# EAGLE design Layer1_v1.0 (EAGLE 6.2)
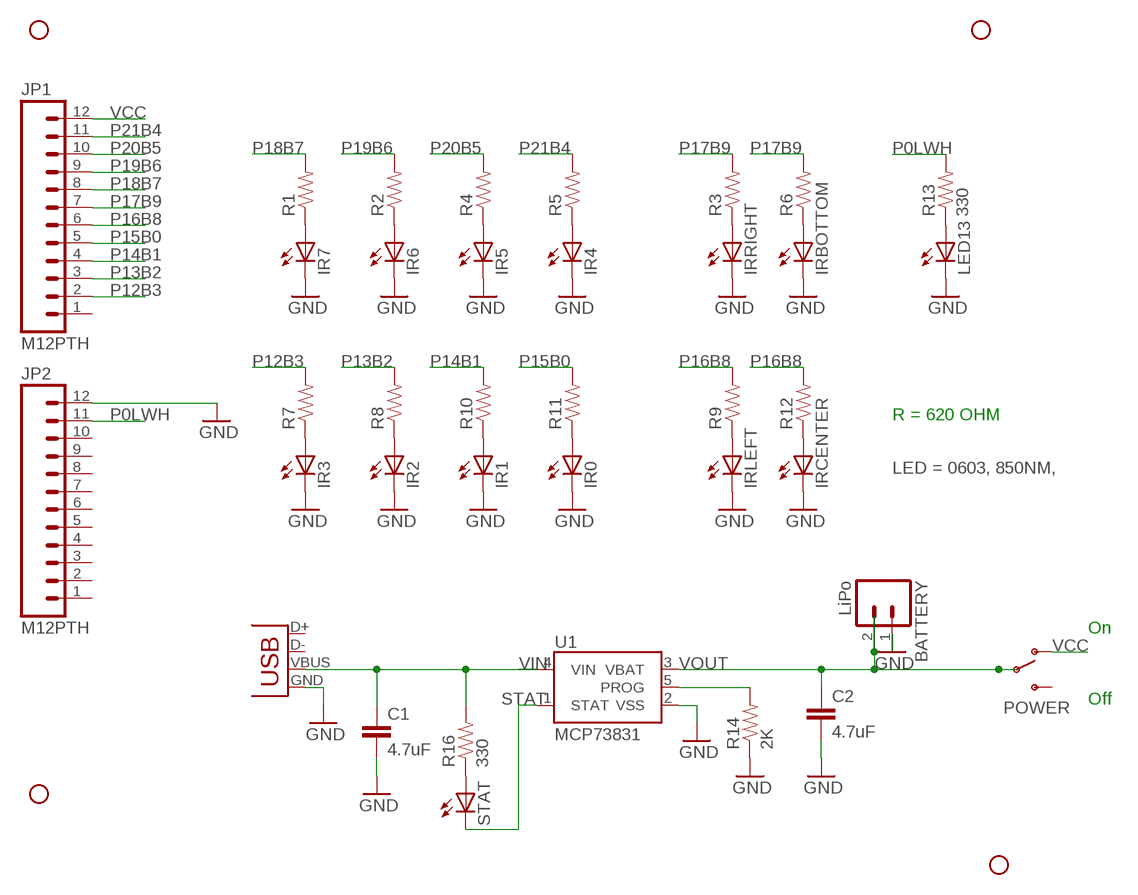
[diagram p0: schematic, sheet 1]

## Parts
BATTERY  LiPo  M02-JST-2MM-SMT  [JST-2-SMD]
C1  4.7uF  CAP0603-CAP  [0603-CAP]
C2  4.7uF  CAP0603-CAP  [0603-CAP]
IR0  LEDCHIPLED_0603  [CHIPLED_0603]
IR1  LEDCHIPLED_0603  [CHIPLED_0603]
IR2  LEDCHIPLED_0603  [CHIPLED_0603]
IR3  LEDCHIPLED_0603  [CHIPLED_0603]
IR4  LEDCHIPLED_0603  [CHIPLED_0603]
IR5  LEDCHIPLED_0603  [CHIPLED_0603]
IR6  LEDCHIPLED_0603  [CHIPLED_0603]
IR7  LEDCHIPLED_0603  [CHIPLED_0603]
IRBOTTOM  LEDCHIPLED_0603  [CHIPLED_0603]
IRCENTER  LEDCHIPLED_0603  [CHIPLED_0603]
IRLEFT  LEDCHIPLED_0603  [CHIPLED_0603]
IRRIGHT  LEDCHIPLED_0603  [CHIPLED_0603]
JP1  M12PTH  [1X12]
JP2  M12PTH  [1X12]
JP4  STAND-OFF  [STAND-OFF]
JP5  STAND-OFF  [STAND-OFF]
JP6  STAND-OFF  [STAND-OFF]
JP7  STAND-OFF  [STAND-OFF]
LED13  LEDCHIPLED_0603  [CHIPLED_0603]
POWER  SWITCH-SPDTPTH  [SWITCH-SPDT]
R1  RESISTOR0603-RES  [0603-RES]
R2  RESISTOR0603-RES  [0603-RES]
R3  RESISTOR0603-RES  [0603-RES]
R4  RESISTOR0603-RES  [0603-RES]
R5  RESISTOR0603-RES  [0603-RES]
R6  RESISTOR0603-RES  [0603-RES]
R7  RESISTOR0603-RES  [0603-RES]
R8  RESISTOR0603-RES  [0603-RES]
R9  RESISTOR0603-RES  [0603-RES]
R10  RESISTOR0603-RES  [0603-RES]
R11  RESISTOR0603-RES  [0603-RES]
R12  RESISTOR0603-RES  [0603-RES]
R13  330  RESISTOR0603-RES  [0603-RES]
R14  2K  RESISTOR0603-RES  [0603-RES]
R16  330  RESISTOR0603-RES  [0603-RES]
STAT  LEDCHIPLED_0603  [CHIPLED_0603]
U1  MCP73831  [SOT23-5]
X1  USBSMD  [USB-MINIB]

## Nets
GND: BATTERY.1 C1.2 C2.2 IR0.C IR1.C IR2.C IR3.C IR4.C IR5.C IR6.C IR7.C IRBOTTOM.C IRCENTER.C IRLEFT.C IRRIGHT.C JP2.12 LED13.C R14.1 U1.2(VSS) X1.GND
N$1: LED13.A R13.1
N$2: IR3.A R7.1
N$3: IRRIGHT.A R3.1
N$4: IR5.A R4.1
N$5: IR4.A R5.1
N$6: IRBOTTOM.A R6.1
N$7: IR6.A R2.1
N$8: IR2.A R8.1
N$9: IRLEFT.A R9.1
N$10: IR1.A R10.1
N$11: IR0.A R11.1
N$12: IRCENTER.A R12.1
N$13: IR7.A R1.1
N$14: R16.1 STAT.A
P0LWH: JP2.11 R13.2
P12B3: JP1.2 R7.2
P13B2: JP1.3 R8.2
P14B1: JP1.4 R10.2
P15B0: JP1.5 R11.2
P16B8: JP1.6 R9.2 R12.2
P17B9: JP1.7 R3.2 R6.2
P18B7: JP1.8 R1.2
P19B6: JP1.9 R2.2
P20B5: JP1.10 R4.2
P21B4: JP1.11 R5.2
PROG: R14.2 U1.5(PROG)
STAT: STAT.C U1.1(STAT)
VCC: JP1.12 POWER.1(O)
VIN: C1.1 R16.2 U1.4(VIN) X1.VBUS
VOUT: BATTERY.2 C2.1 POWER.2(P) U1.3(VBAT)
Unconnected: JP1.1 JP2.1 JP2.2 JP2.3 JP2.4 JP2.5 JP2.6 JP2.7 JP2.8 JP2.9 JP2.10 POWER.3(S) X1.D+ X1.D-

## Notes on the sheet
- R = 620 OHM
- LED = 0603, 850NM,
- On
- Off

## Library data of the parts
BATTERY = SparkFun-Connectors:M02: Header 2 Standard 2-pin 0.1" header. Use with straight break away headers (SKU : PRT-00116), right angle break away headers (PRT-00553), swiss pins (PRT-00743), machine pins (PRT-00117), and female headers (PRT-00115). Molex polarized connector foot print use with SKU : PRT-08233 with associated crimp pins and housings.
C1 C2 = SparkFun-Passives:CAP: Capacitor Standard 0603 ceramic capacitor, and 0.1" leaded capacitor.
IR0 IR1-IR7 IRBOTTOM IRCENTER IRLEFT IRRIGHT LED13 STAT = adafruit:LED: LED OSRAM: - CHIPLED LG R971, LG N971, LY N971, LG Q971, LY Q971, LO R971, LY R971 LH N974, LH R974 LS Q976, LO Q976, LY Q976 LO Q996 - Hyper CHIPLED LW Q18S LB Q993, LB Q99A, LB R99A - SideLED LS A670, LO A670, LY A670, LG A670, LP A670 LB A673, LV A673, LT A673, LW A673 LH A674 LY A675 LS A676, LA A676, LO A676, LY A676, LW A676 LS A679, LY A679, LG A679 - Hyper Micro SIDELED® LS Y876, LA Y876, LO Y876, LY Y876 LT Y87S - SmartLED LW L88C, LW L88S LB L89C, LB L89S, LG L890 LS L89K, LO L89K, LY L89K LS L896, LA L896, LO L896, LY L896 - TOPLED LS T670, LO T670, LY T670, LG T670, LP T670 LSG T670, LSP T670, LSY T670, LOP T670, LYG T670 LG T671, LOG T671, LSG T671 LB T673, LV T673, LT T673, LW T673 LH T674 LS T676, LA T676, LO T676, LY T676, LB T676, LH T676, LSB T676, LW T676 LB T67C, LV T67C, LT T67C, LS T67K, LO T67K, LY T67K, LW E67C LS E67B, LA E67B, LO E67B, LY E67B, LB E67C, LV E67C, LT E67C LW T67C LS T679, LY T679, LG T679 LS T770, LO T770, LY T770, LG T770, LP T770 LB T773, LV T773, LT T773, LW T773 LH T774 LS E675, LA E675, LY E675, LS T675 LS T776, LA T776, LO T776, LY T776, LB T776 LHGB T686 LT T68C, LB T68C - Hyper Mini TOPLED® LB M676 - Mini TOPLED Santana® LG M470 LS M47K, LO M47K, LY M47K Source: http://www.osram.convergy.de/
JP1 JP2 = SparkFun-Connectors:M12: Header 12 Standard 12-pin 0.1" header. Use with straight break away headers (SKU : PRT-00116), right angle break away headers (PRT-00553), swiss pins (PRT-00743), machine pins (PRT-00117), and female headers (PRT-00115).
JP4-JP7 = SparkFun-Electromechanical:STAND-OFF: #4 Stand Off This is the mechanical footprint for a #4 phillips button head screw. Use the keepout ring to avoid running the screw head into surrounding components. SKU : PRT-00447
POWER = SparkFun-Electromechanical:SWITCH-SPDT: SPST Switch Simple slide switch. Spark Fun Electronics SKU : COM-00102
R1-R14 R16 = SparkFun-Passives:RESISTOR: Resistor Basic schematic elements and footprints for 0603, 1206, and PTH resistors.
U1 = SparkFun-PowerIC:MCP73831: Miniature single cell, fully integrated Li-Ion, Li-polymer charge management controller http://ww1.microchip.com/downloads/en/DeviceDoc/21984a.pdf
X1 = SparkFun-Connectors:USB: USB Connectors USB-B-PTH is fully proven SKU : PRT-00139 USB-miniB is fully proven SKU : PRT-00587 USB-A-PCB is untested. USB-A-H is throughly reviewed, but untested. Spark Fun Electronics SKU : PRT-00437 USB-B-SMT is throughly reviewed, but untested. Needs silkscreen touching up. USB-A-S has not been used/tested USB-MB-H has not been used/tested

## Board
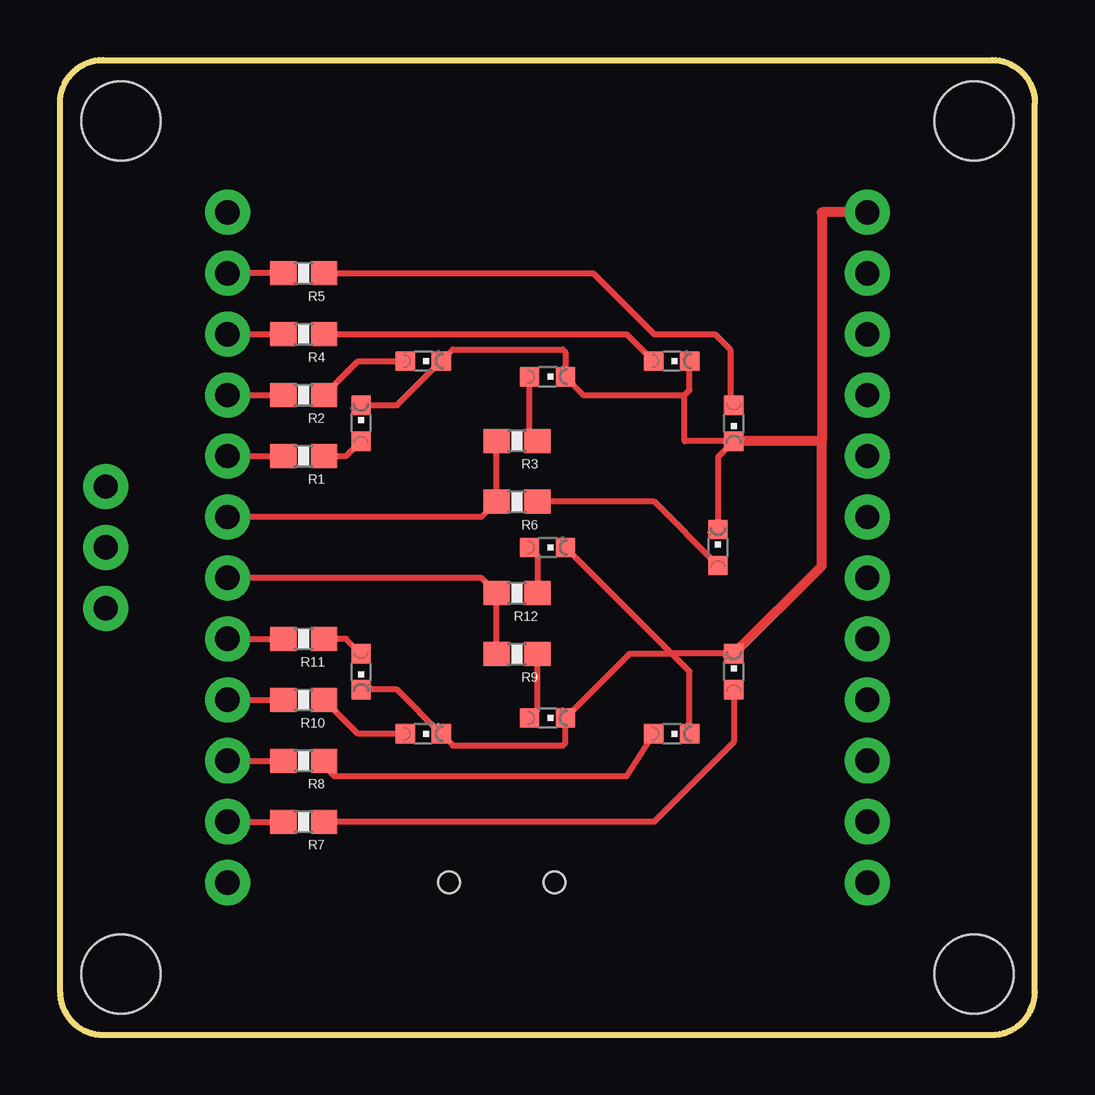
[diagram p1: board, top side]
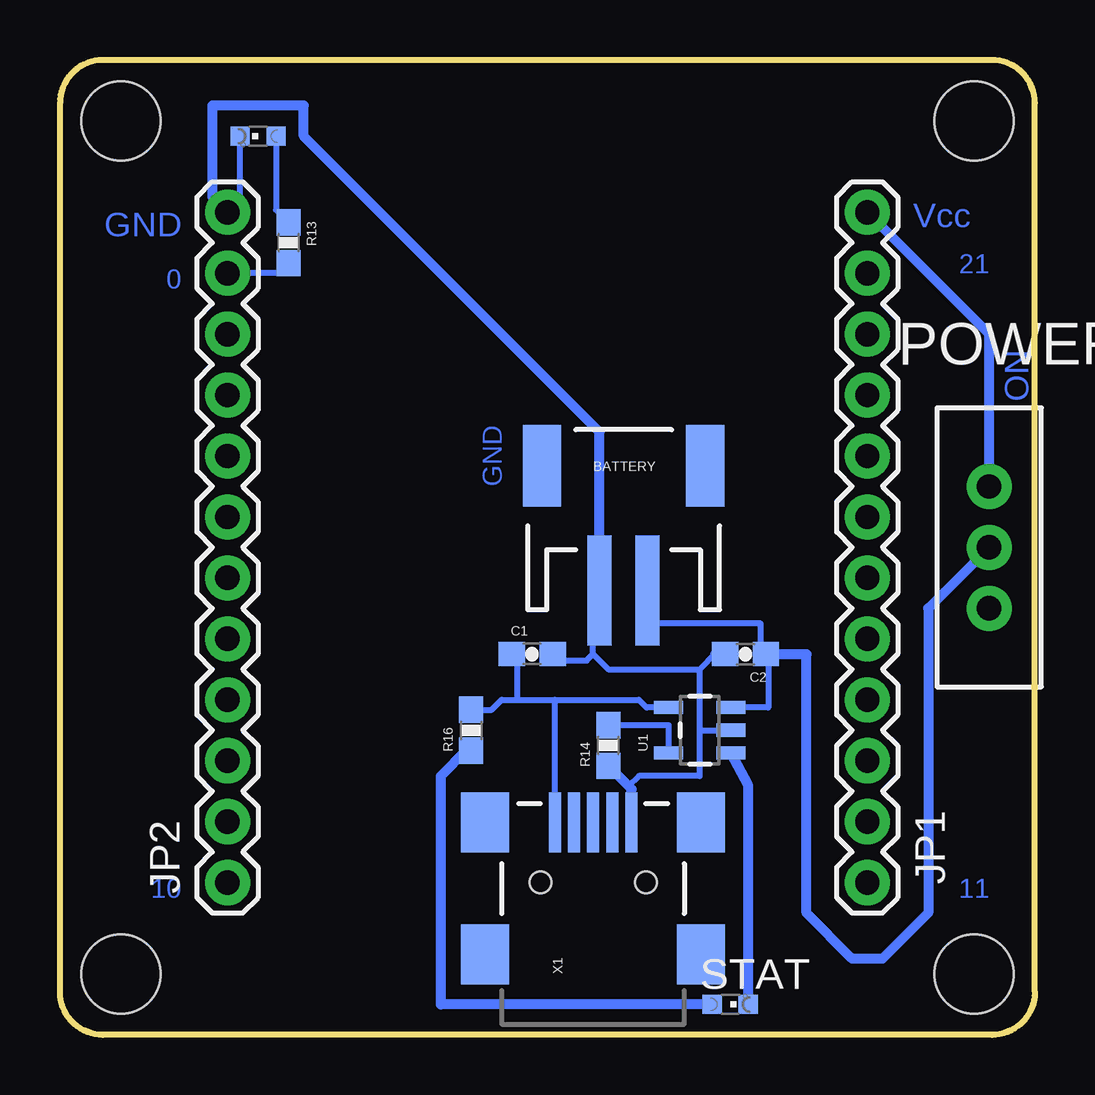
[diagram p2: board, bottom side, seen from below]

Size 40.64 x 40.64 mm. Coordinates in mm from the lower left corner, seen from the top.
Outline: 0,1.8 0,38.84 arc-90 1.8,40.64 38.84,40.64 arc-90 40.64,38.84 40.64,1.8 arc-90 38.84,0 1.8,0 arc-90 0,1.8
Copper layers (1*16): Top 0.035mm / dielectric 1.5mm / Bottom 0.035mm
Design rules: minimum track width 6mil, minimum drill 24mil, track to track 8mil, track to pad 8mil, pad to pad 8mil, via to via 8mil, smd to smd 8mil, copper to edge 40mil, drill to drill 8mil, minimum pad ring 10mil, minimum via ring 8mil, stop-mask expansion 4mil, vias tented up to drill 0mil, thermal gap 10mil

### Footprints (pad centres in the part's own frame; a part is rotated, then mirrored left to right if it is on the bottom)
JST-2-SMD = smd 1 x 4.6: 1 -1,-3.7; 2 1,-3.7 | smd 1.6 x 3.4: NC1 -3.4,1.5; NC2 3.4,1.5
0603-CAP = smd 1.1 x 1: 1 -0.85,0; 2 0.85,0
CHIPLED_0603 = smd 0.8 x 0.8: A 0,-0.75; C 0,0.75
1X12 = drill 1.016 pad 1.88: 1 0,0; 2 2.54,0; 3 5.08,0; 4 7.62,0; 5 10.16,0; 6 12.7,0; 7 15.24,0; 8 17.78,0; 9 20.32,0; 10 22.86,0; 11 25.4,0; 12 27.94,0
STAND-OFF = hole 3.302: 0,0
SWITCH-SPDT = drill 1.016 pad 1.88: 1 0,2.54; 2 0,0; 3 0,-2.54
0603-RES = smd 1.1 x 1: 1 -0.85,0; 2 0.85,0
SOT23-5 = smd 0.55 x 1.2: 1 -0.95,-1.3; 2 0,-1.3; 3 0.95,-1.3; 4 0.95,1.3; 5 -0.95,1.3
USB-MINIB = smd 2.5 x 0.5: D+ 2.5,0; D- 2.5,0.8; GND 2.5,-1.6; ID 2.5,-0.8; VBUS 2.5,1.6 | smd 2.5 x 2: MTN1 -3,4.5; MTN2 2.5,4.5; MTN3 -3,-4.5; MTN4 2.5,-4.5 | hole 0.9: 0,2.2; 0,-2.2

### Placement (x,y rotation side)
BATTERY  17.14,22.23 0 bottom
C1  20.95,15.88 0 bottom
C2  12.06,15.88 180 bottom
IR0  12.55,15.14 180 top
IR1  15.14,12.55 270 top
IR2  25.5,12.55 270 top
IR3  28.09,15.14 0 top
IR4  28.09,25.5 180 top
IR5  25.5,28.09 270 top
IR6  15.14,28.09 270 top
IR7  12.55,25.5 0 top
IRBOTTOM  27.43,20.32 0 top
IRCENTER  20.32,20.32 270 top
IRLEFT  20.32,13.21 270 top
IRRIGHT  20.32,27.43 270 top
JP1  6.99,6.35 90 bottom
JP2  33.66,6.35 90 bottom
JP4  38.1,2.54 0 top
JP5  2.54,2.54 0 top
JP6  2.54,38.1 0 top
JP7  38.1,38.1 0 top
LED13  32.38,37.47 90 bottom
POWER  1.91,20.32 0 bottom
R1  10.16,24.13 180 top
R2  10.16,26.67 180 top
R3  19.05,24.77 180 top
R4  10.16,29.21 180 top
R5  10.16,31.75 180 top
R6  19.05,22.23 180 top
R7  10.16,8.89 180 top
R8  10.16,11.43 180 top
R9  19.05,15.88 180 top
R10  10.16,13.97 180 top
R11  10.16,16.51 180 top
R12  19.05,18.41 180 top
R13  31.11,33.02 270 bottom
R14  17.78,12.06 90 bottom
R16  23.5,12.7 90 bottom
STAT  12.7,1.27 270 bottom
U1  13.97,12.7 90 bottom
X1  18.41,6.35 90 bottom

### Tracks (layer width: path | path; a pad name or v marks a point on that pad's centre or on a via)
GND
  Top 0.254: IR7.C 14.05,26.25 IR6.C 16.38,28.57 20.95,28.57 21.07,28.46 IRRIGHT.C 21.83,26.67 26.04,26.67 | 26.04,26.67 26.25,26.88 IR5.C | 26.04,26.67 26.04,24.75 IR4.C 27.43,24.09 IRBOTTOM.C | IR3.C 25.5,15.89 | 25.5,15.89 IRCENTER.C | IR0.C 14.05,14.39 IR1.C 16.38,12.06 20.95,12.06 21.07,12.18 IRLEFT.C 23.75,15.89 25.5,15.89 | IR2.C 26.25,15.14 25.5,15.89
  Top 0.406: JP2.12 31.75,34.29 31.75,24.77 | 31.75,24.77 28.09,24.77 IR4.C | IR3.C 31.75,19.56 31.75,24.77
  Bottom 0.254: JP2.12 33.13,34.81 LED13.C | 13.97,15.24 17.78,15.24 18.41,15.88 | 13.97,12.7 U1.2 | 13.97,12.7 13.97,10.79 16.51,10.79 16.93,10.37 | C1.2 19.84,15.61 18.68,15.61 18.41,15.88 | 18.41,15.88 18.41,18.25 BATTERY.1 | 13.34,15.88 13.97,15.24 | 13.97,12.7 13.97,15.24
  Bottom 0.406: X1.GND 16.82,10.25 16.93,10.37 R14.1 | 13.34,15.88 C2.2 | BATTERY.1 18.14,25.13 30.48,37.47 30.48,38.73 34.29,38.73 34.29,34.92 JP2.12
N$1
  Bottom 0.254: LED13.A 31.64,34.39 R13.1
N$2
  Top 0.254: IR3.A 28.09,12.21 24.77,8.89 R7.1
N$3
  Top 0.254: R3.1 19.57,25.09 IRRIGHT.A
N$4
  Top 0.254: R4.1 23.62,29.21 IR5.A
N$5
  Top 0.254: R5.1 22.23,31.75 24.77,29.21 27.3,29.21 27.94,28.57 27.94,26.39 IR4.A
N$6
  Top 0.254: IRBOTTOM.A 24.78,22.23 R6.1
N$7
  Top 0.254: R2.1 12.43,28.09 IR6.A
N$8
  Top 0.254: IR2.A 23.62,10.79 11.43,10.79 11.01,11.21 R8.1
N$9
  Top 0.254: IRLEFT.A 19.9,13.54 R9.1
N$10
  Top 0.254: IR1.A 12.43,12.55 R10.1
N$11
  Top 0.254: IR0.A 11.94,16.51 R11.1
N$12
  Top 0.254: IRCENTER.A 19.9,19.99 R12.1
N$13
  Top 0.254: R1.1 11.94,24.13 IR7.A
N$14
  Bottom 0.254: R16.1 23.71,11.85
  Bottom 0.406: STAT.A 24.77,1.27 24.77,10.79 23.71,11.85
P0LWH
  Bottom 0.254: R13.2 30.9,31.75 JP2.11
P12B3
  Top 0.254: JP1.2 R7.2
P13B2
  Top 0.254: JP1.3 R8.2
P14B1
  Top 0.254: JP1.4 R10.2
P15B0
  Top 0.254: JP1.5 R11.2
P16B8
  Top 0.254: R9.2 R12.2 17.57,19.05 JP1.6
P17B9
  Top 0.254: R3.2 R6.2 17.57,21.59 JP1.7
P18B7
  Top 0.254: JP1.8 R1.2
P19B6
  Top 0.254: JP1.9 R2.2
P20B5
  Top 0.254: JP1.10 R4.2
P21B4
  Top 0.254: R5.2 JP1.11
PROG
  Bottom 0.254: R14.2 15.27,12.91 U1.5
STAT
  Bottom 0.406: STAT.C 11.95,10.39 U1.1
VCC
  Bottom 0.406: POWER.1 1.91,29.21 JP1.12
VIN
  Bottom 0.254: 20.02,13.97 16.51,13.97 16.19,13.65 U1.4 | 23.5,13.34 R16.2 22.64,13.55 22.23,13.97 21.59,13.97 | X1.VBUS 20.02,13.97 | 21.59,13.97 20.02,13.97 | C1.1 21.59,15.66 21.59,13.97
VOUT
  Bottom 0.254: 11.11,15.88 11.11,13.65 U1.3 | C2.1 11.43,16.09 11.43,17.14 15.88,17.14 16.14,17.41 BATTERY.2
  Bottom 0.406: POWER.2 4.45,17.78 4.45,5.08 6.35,3.17 7.62,3.17 9.53,5.08 9.53,15.88 11.11,15.88 C2.1

### Text on the board
Bottom: Vcc | GND | 21 | 0 | ON | GND | 11 | 10